# EAGLE design TCA0372_x (EAGLE 9.3.0)
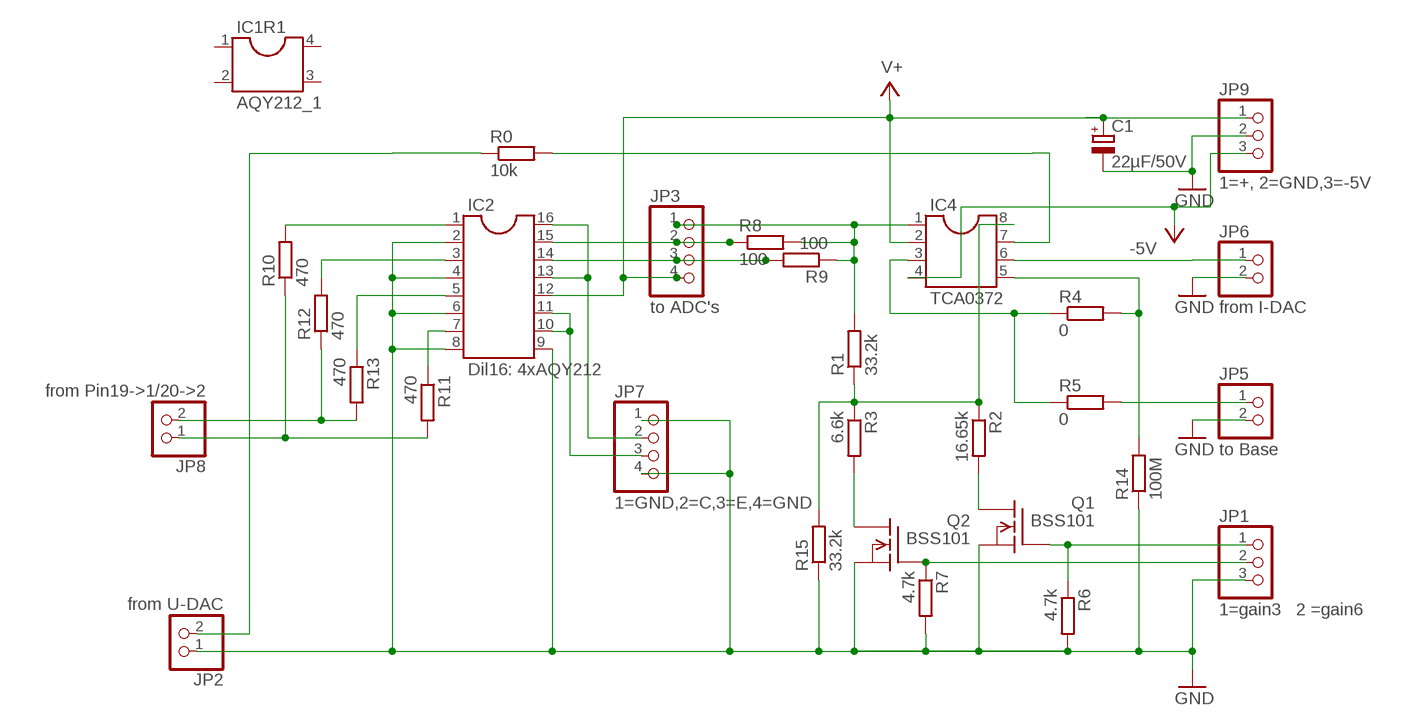
[diagram p0: schematic, sheet 1]

## Parts
C1  22µF/50V  CPOL-EUE5-10.5  [E5-10,5]
IC1R1  AQY212_1  DIL4S  [SOCKET-04]
IC2  Dil16: 4xAQY212  DIL16S  [SOCKET-16]
IC4  TCA0372  DIL8S  [SOCKET-08]
JP1  1=gain3 2 =gain6  PINHD-1X3  [1X03]
JP2  from U-DAC  PINHD-1X2  [1X02]
JP3  to ADC's  PINHD-1X4  [1X04]
JP5  to Base  PINHD-1X2  [1X02]
JP6  from I-DAC  PINHD-1X2  [1X02]
JP7  1=GND,2=C,3=E,4=GND  PINHD-1X4  [1X04]
JP8  from Pin19->1/20->2  PINHD-1X2  [1X02]
JP9  1=+, 2=GND,3=-5V  PINHD-1X3  [1X03]
Q1  BSS101  [TO92]
Q2  BSS101  [TO92]
R0  10k  R-EU_0207/7  [0207/7]
R1  33.2k  R-EU_0207/7  [0207/7]
R2  16.65k  R-EU_0207/7  [0207/7]
R3  6.6k  R-EU_0207/7  [0207/7]
R4  0  R-EU_0207/7  [0207/7]
R5  0  R-EU_0207/7  [0207/7]
R6  4.7k  R-EU_0207/7  [0207/7]
R7  4.7k  R-EU_0207/7  [0207/7]
R8  100  R-EU_0207/7  [0207/7]
R9  100  R-EU_0207/7  [0207/7]
R10  470  R-EU_0207/7  [0207/7]
R11  470  R-EU_0207/7  [0207/7]
R12  470  R-EU_0207/7  [0207/7]
R13  470  R-EU_0207/7  [0207/7]
R14  100M  R-EU_0207/7  [0207/7]
R15  33.2k  R-EU_0207/7  [0207/7]

## Nets
-5V: IC4.4 JP9.3
GND: C1.- IC2.2 IC2.4 IC2.6 IC2.8 IC2.9 JP1.3 JP2.1 JP5.2 JP6.2 JP7.1 JP7.4 JP9.2 Q1.1(S) Q2.1(S) R6.2 R7.2 R14.1 R15.1
N$1: IC4.5 R4.2 R14.2
N$2: IC2.15 JP3.2 R8.1
N$3: IC4.7 R0.2
N$5: Q1.3(D) R2.2
N$6: Q2.3(D) R3.2
N$7: JP1.1 Q1.2(G) R6.1
N$8: JP1.2 Q2.2(G) R7.1
N$9: IC4.6 JP6.1
N$10: IC2.3 R12.2
N$11: IC2.13 IC2.16 JP7.2
N$12: JP2.2 R0.1
N$13: IC4.3 R4.1 R5.1
N$15: IC2.5 R13.1
N$16: JP8.2 R12.1 R13.2
N$17: IC2.1 R10.2
N$18: IC2.7 R11.1
N$19: JP8.1 R10.1 R11.2
N$20: JP5.1 R5.2
N$21: IC4.1 JP3.1 R1.2 R8.2 R9.1
N$22: IC4.8 R1.1 R2.1 R3.1 R15.2
N$23: IC2.10 IC2.11 JP7.3
N$25: IC2.14 JP3.3 R9.2
V+: C1.+ IC2.12 IC4.2 JP3.4 JP9.1
Unconnected: IC1R1.1 IC1R1.2 IC1R1.3 IC1R1.4

## Library data of the parts
C1 = rcl:CPOL-EU: POLARIZED CAPACITOR, European symbol; SPICEPREFIX: C
IC1R1 = ic-package:DIL4: Dual In Line / Socket
IC2 = ic-package:DIL16: Dual In Line / Socket
IC4 = ic-package:DIL8: Dual In Line / Socket
JP1 JP9 = pinhead:PINHD-1X3: PIN HEADER
JP2 JP5 JP6 JP8 = pinhead:PINHD-1X2: PIN HEADER
JP3 JP7 = pinhead:PINHD-1X4: PIN HEADER
Q1 Q2 = transistor-fet:BSS101: N-Channel Enhancement MOSFET 200V; 0,16A; 11Ohm
R0 R1-R15 = rcl:R-EU_: RESISTOR, European symbol; SPICEPREFIX: R

## Board
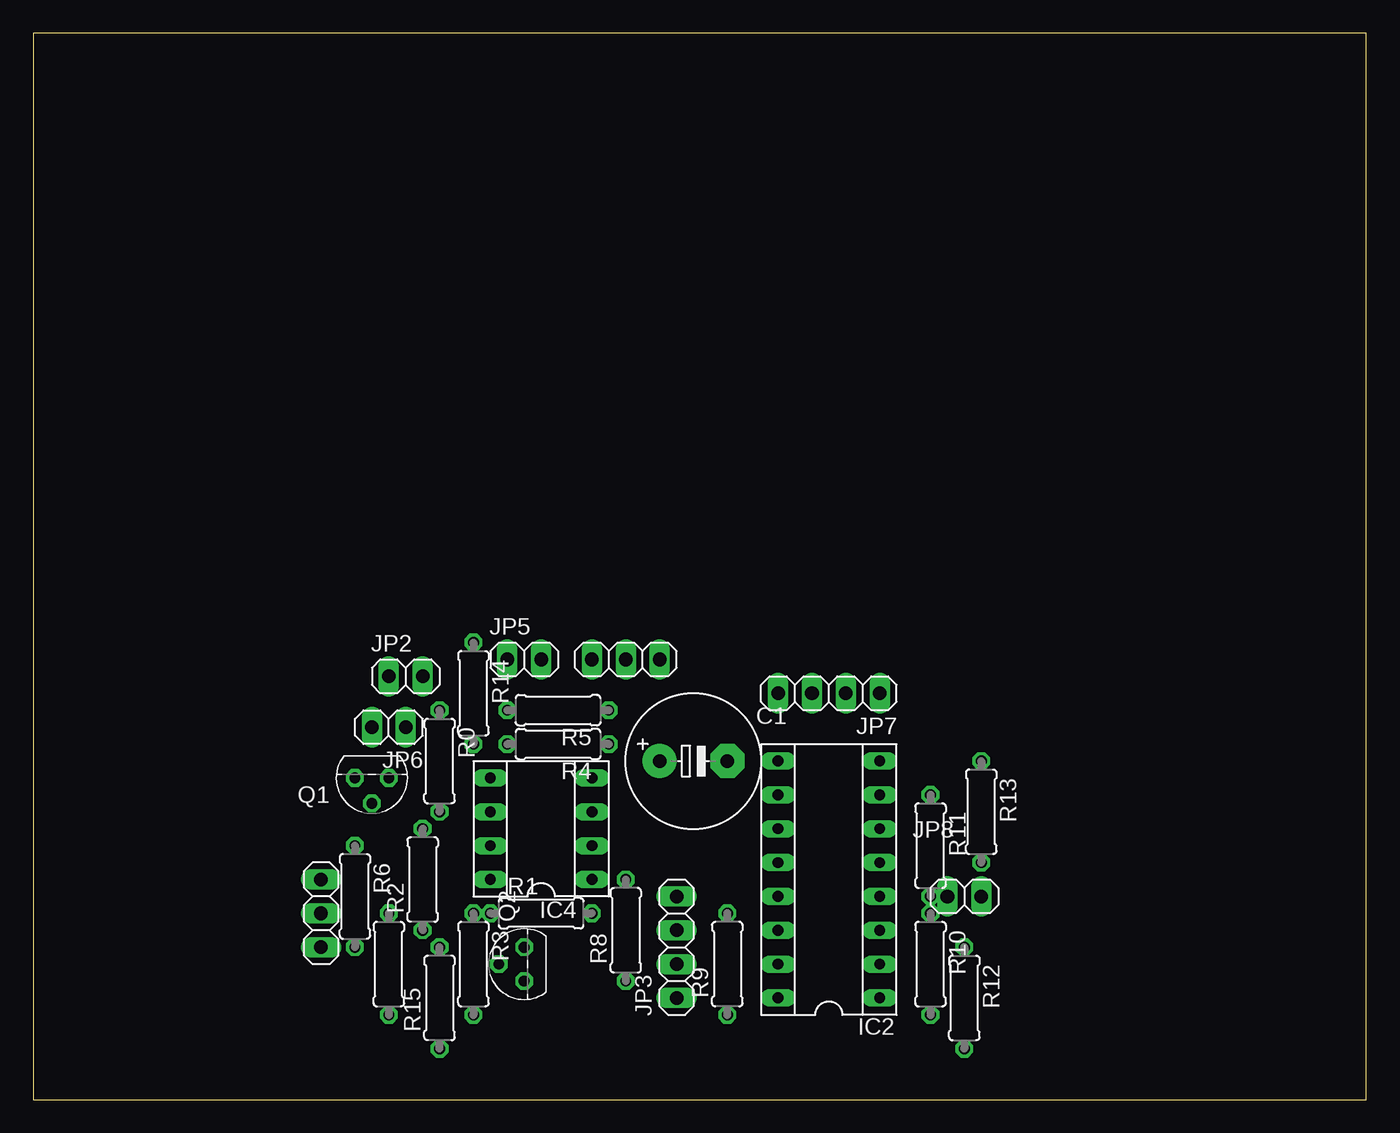
[diagram p1: board, top side]
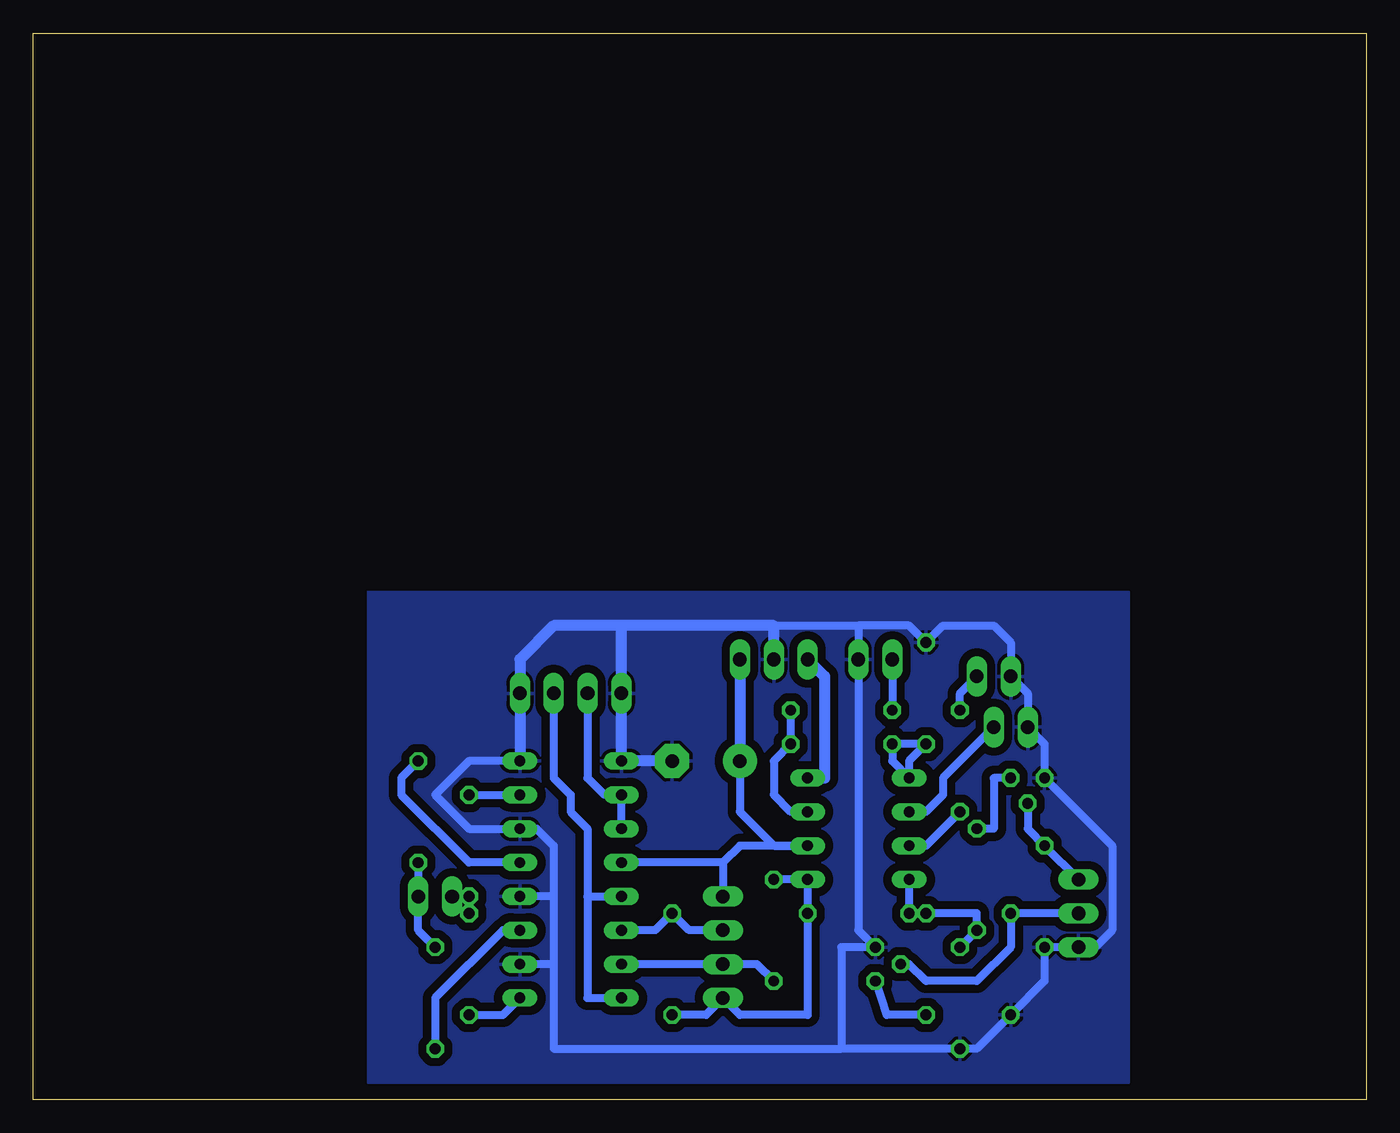
[diagram p2: board, bottom side, seen from below]

Size 100 x 80 mm. Coordinates in mm from the lower left corner, seen from the top.
Outline: 0,0 100,0 100,80 0,80 0,0
Copper layers (1*16): Top 0.035mm / dielectric 1.5mm / Bottom 0.035mm
Design rules "default": minimum track width 6mil, minimum drill 0.35mm, track to track 6mil, track to pad 6mil, pad to pad 6mil, via to via 6mil, smd to smd 6mil, copper to edge 40mil, drill to drill 6mil, minimum pad ring 10mil, minimum via ring 8mil, stop-mask expansion 4mil, vias tented up to drill 0mil, thermal gap 10mil

### Footprints (pad centres in the part's own frame; a part is rotated, then mirrored left to right if it is on the bottom)
E5-10,5 = drill 1.016 pad 2.54: + -2.54,0 | drill 1.016 pad 2.54 octagon: - 2.54,0
SOCKET-04 = drill 0.813 long: 1 -1.27,-3.81; 2 1.27,-3.81; 3 1.27,3.81; 4 -1.27,3.81
SOCKET-16 = drill 0.813 long: 1 -8.89,-3.81; 2 -6.35,-3.81; 3 -3.81,-3.81; 4 -1.27,-3.81; 5 1.27,-3.81; 6 3.81,-3.81; 7 6.35,-3.81; 8 8.89,-3.81; 9 8.89,3.81; 10 6.35,3.81; 11 3.81,3.81; 12 1.27,3.81; 13 -1.27,3.81; 14 -3.81,3.81; 15 -6.35,3.81; 16 -8.89,3.81
SOCKET-08 = drill 0.813 long: 1 -3.81,-3.81; 2 -1.27,-3.81; 3 1.27,-3.81; 4 3.81,-3.81; 5 3.81,3.81; 6 1.27,3.81; 7 -1.27,3.81; 8 -3.81,3.81
1X03 = drill 1.016 long: 1 -2.54,0; 2 0,0; 3 2.54,0
1X02 = drill 1.016 long: 1 -1.27,0; 2 1.27,0
1X04 = drill 1.016 long: 1 -3.81,0; 2 -1.27,0; 3 1.27,0; 4 3.81,0
TO92 = drill 0.813 octagon: 1 1.27,0; 2 0,1.905; 3 -1.27,0
0207/7 = drill 0.813 octagon: 1 -3.81,0; 2 3.81,0

### Placement (x,y rotation side)
C1  49.53,25.4 0 top
IC1R1  -5.08,-11.43 0 top  (outside the outline)
IC2  59.69,16.51 90 top
IC4  38.1,20.32 90 top
JP1  21.59,13.97 270 top
JP2  27.94,31.75 0 top
JP3  48.26,11.43 90 top
JP5  36.83,33.02 0 top
JP6  26.67,27.94 180 top
JP7  59.69,30.48 180 top
JP8  69.85,15.24 0 top
JP9  44.45,33.02 180 top
Q1  25.4,24.13 180 top
Q2  36.83,10.16 90 top
R0  30.48,25.4 270 top
R1  38.1,13.97 0 top
R2  29.21,16.51 90 top
R3  33.02,10.16 270 top
R4  39.37,26.67 180 top
R5  39.37,29.21 180 top
R6  24.13,15.24 270 top
R7  26.67,10.16 270 top
R8  44.45,12.7 90 top
R9  52.07,10.16 90 top
R10  67.31,10.16 270 top
R11  67.31,19.05 270 top
R12  69.85,7.62 270 top
R13  71.12,21.59 270 top
R14  33.02,30.48 270 top
R15  30.48,7.62 90 top

### Tracks (layer width: path | path; a pad name or v marks a point on that pad's centre or on a via)
-5V
  Bottom 0.813: JP9.3 40.64,31.75 40.64,24.13 IC4.4
GND
  Bottom 0.61: 38.1,35.56 JP5.2 38.1,12.7 Q2.1 39.37,11.43 39.37,3.81 | 38.1,35.56 34.29,35.56 R14.1 31.75,35.56 27.94,35.56 26.67,34.29 JP2.1 25.4,30.48 JP6.2 24.13,26.67 Q1.1 19.05,19.05 19.05,12.7 20.32,11.43 JP1.3 R6.2 24.13,8.89 R7.2 29.21,3.81 R15.1 39.37,3.81 | 44.45,35.56 38.1,35.56 | 60.96,15.24 60.96,19.05 62.23,20.32 IC2.6 67.31,20.32 69.85,22.86 67.31,25.4 IC2.8 | 60.96,15.24 60.96,10.16 | 60.96,10.16 60.96,3.81 39.37,3.81 | 60.96,10.16 IC2.2 | 60.96,15.24 IC2.4
  Bottom 0.813: JP9.2 44.45,35.56 55.88,35.56 | IC2.8 JP7.1 63.5,33.02 60.96,35.56 55.88,35.56 | C1.- IC2.9 JP7.4 55.88,35.56
  pour Bottom (isolate 0.61): 17.78,38.1 74.93,38.1 74.93,1.27 17.78,1.27
N$1
  Bottom 0.61: 35.56,25.4 IC4.5 34.29,25.4 R14.2 R4.2 35.56,25.4
N$2
  Bottom 0.61: R8.1 45.72,10.16 JP3.2 IC2.15
N$3
  Bottom 0.61: IC4.7 33.02,19.05 R0.2
N$5
  Bottom 0.61: Q1.3 27.94,24.13 27.94,20.32 R2.2
N$6
  Bottom 0.61: Q2.3 35.98,6.35 R3.2
N$7
  Bottom 0.61: Q1.2 25.4,20.32 R6.1 JP1.1
N$8
  Bottom 0.61: Q2.2 34.29,10.16 33.02,8.89 29.21,8.89 26.67,11.43 R7.1 JP1.2
N$9
  Bottom 0.61: IC4.6 33.02,21.59 31.75,22.86 31.75,24.13 JP6.1
N$10
  Bottom 0.61: IC2.3 64.77,12.7 69.85,7.62 R12.2
N$11
  Bottom 0.61: 58.42,15.24 58.42,20.32 59.69,21.59 59.69,22.86 60.96,24.13 JP7.2 | 58.42,15.24 IC2.13 | 58.42,15.24 58.42,7.62 IC2.16
N$12
  Bottom 0.61: R0.1 30.48,30.48 JP2.2
N$13
  Bottom 0.61: R5.1 R4.1 44.45,25.4 44.45,22.86 43.18,21.59 IC4.3
N$15
  Bottom 0.61: IC2.5 67.31,17.78 72.39,22.86 72.39,24.13 R13.1
N$16
  Bottom 0.61: R12.1 71.12,12.7 JP8.2 R13.2
N$17
  Bottom 0.61: R10.2 64.77,6.35 IC2.1
N$18
  Bottom 0.61: R11.1 IC2.7
N$19
  Bottom 0.61: R10.1 R11.2 JP8.1
N$20
  Bottom 0.61: JP5.1 R5.2
N$21
  Bottom 0.61: R9.1 49.53,6.35 JP3.1 46.99,6.35 41.91,6.35 41.91,12.7 R1.2 IC4.1 R8.2
N$22
  Bottom 0.61: IC4.8 R1.1 R3.1 29.21,13.97 R2.1 R15.2
N$23
  Bottom 0.61: IC2.11 IC2.10 57.15,22.86 58.42,24.13 JP7.3
N$25
  Bottom 0.61: JP3.3 50.8,12.7 R9.2 53.34,12.7 IC2.14
V+
  Bottom 0.152: 44.45,19.05 46.99,19.05
  Bottom 0.61: 48.26,17.78 JP3.4 | 48.26,17.78 IC2.12 | C1.+ 46.99,21.59 44.45,19.05 IC4.2 46.99,19.05 48.26,17.78
  Bottom 0.813: JP9.1 C1.+